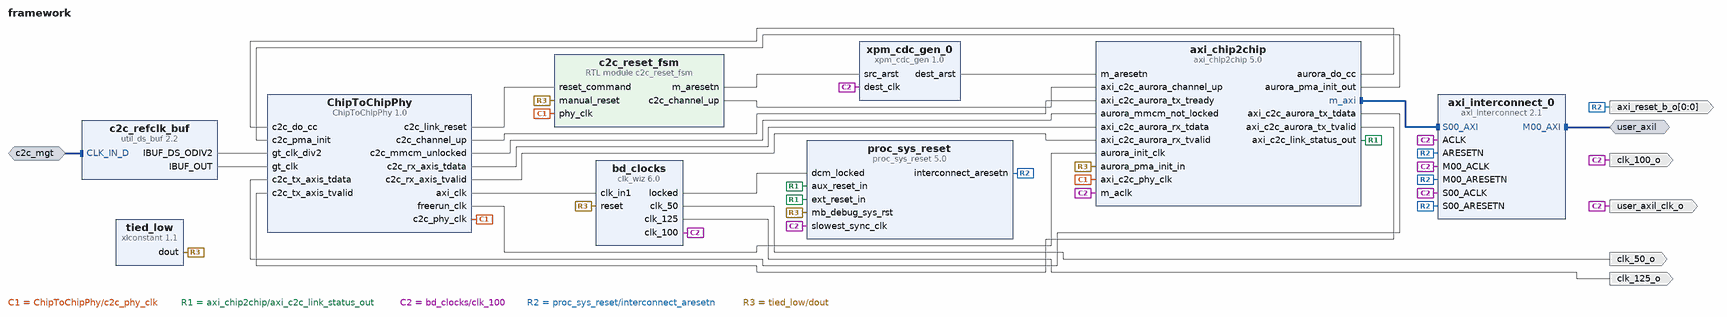
[diagram p0: block diagram of the top level]
# Vivado block design framework, xcvu13p-fsga2577-1-e, Vivado 2021.1
create_bd_design framework

create_bd_intf_port -mode Slave -vlnv xilinx.com:interface:diff_clock_rtl:1.0 c2c_mgt
create_bd_intf_port -mode Master -vlnv xilinx.com:interface:aximm_rtl:1.0 user_axil
set_property -dict [list \
  CONFIG.ADDR_WIDTH 32 \
  CONFIG.DATA_WIDTH 32 \
  CONFIG.HAS_BURST 0 \
  CONFIG.HAS_CACHE 0 \
  CONFIG.HAS_LOCK 0 \
  CONFIG.HAS_QOS 0 \
  CONFIG.HAS_REGION 0 \
  CONFIG.PROTOCOL AXI4LITE \
] [get_bd_intf_ports user_axil]
create_bd_port -dir O -type clk clk_50_o
set_property -dict {CONFIG.FREQ_HZ 50000000} [get_bd_ports clk_50_o]
create_bd_port -dir O -type clk clk_100_o
create_bd_port -dir O -type clk user_axil_clk_o
set_property -dict {CONFIG.ASSOCIATED_BUSIF user_axil CONFIG.ASSOCIATED_RESET axi_reset_b_o} [get_bd_ports user_axil_clk_o]
create_bd_port -dir O -from 0 -to 0 -type rst axi_reset_b_o
create_bd_port -dir O -type clk clk_125_o
set_property -dict {CONFIG.FREQ_HZ 125000000} [get_bd_ports clk_125_o]

create_bd_cell -type ip -vlnv xilinx.com:ip:axi_chip2chip:5.0 axi_chip2chip
set_property -dict [list \
  CONFIG.C_ECC_ENABLE false \
  CONFIG.C_EN_AXI_LINK_HNDLR true \
  CONFIG.C_INCLUDE_AXILITE 0 \
  CONFIG.C_INTERFACE_MODE 1 \
  CONFIG.C_INTERFACE_TYPE 3 \
  CONFIG.C_MASTER_FPGA 0 \
  CONFIG.C_M_AXI_WUSER_WIDTH 0 \
] [get_bd_cells axi_chip2chip]
create_bd_cell -type ip -vlnv xilinx.com:ip:axi_interconnect:2.1 axi_interconnect_0
set_property -dict {CONFIG.NUM_MI 1} [get_bd_cells axi_interconnect_0]
create_bd_cell -type module -reference c2c_reset_fsm c2c_reset_fsm
create_bd_cell -type ip -vlnv xilinx.com:ip:clk_wiz:6.0 bd_clocks
set_property -dict [list \
  CONFIG.CLKIN1_JITTER_PS 64.0 \
  CONFIG.CLKOUT1_JITTER 222.272 \
  CONFIG.CLKOUT1_PHASE_ERROR 204.239 \
  CONFIG.CLKOUT1_REQUESTED_OUT_FREQ 50 \
  CONFIG.CLKOUT2_JITTER 194.337 \
  CONFIG.CLKOUT2_PHASE_ERROR 204.239 \
  CONFIG.CLKOUT2_USED true \
  CONFIG.CLKOUT3_JITTER 186.558 \
  CONFIG.CLKOUT3_PHASE_ERROR 204.239 \
  CONFIG.CLKOUT3_REQUESTED_OUT_FREQ 125 \
  CONFIG.CLKOUT3_USED true \
  CONFIG.CLK_OUT1_PORT clk_50 \
  CONFIG.CLK_OUT2_PORT clk_100 \
  CONFIG.CLK_OUT3_PORT clk_125 \
  CONFIG.MMCM_CLKFBOUT_MULT_F 32.000 \
  CONFIG.MMCM_CLKIN1_PERIOD 6.400 \
  CONFIG.MMCM_CLKIN2_PERIOD 10.0 \
  CONFIG.MMCM_CLKOUT0_DIVIDE_F 20.000 \
  CONFIG.MMCM_CLKOUT1_DIVIDE 10 \
  CONFIG.MMCM_CLKOUT2_DIVIDE 8 \
  CONFIG.MMCM_DIVCLK_DIVIDE 5 \
  CONFIG.NUM_OUT_CLKS 3 \
  CONFIG.OPTIMIZE_CLOCKING_STRUCTURE_EN true \
  CONFIG.PRIM_IN_FREQ 156.25 \
  CONFIG.PRIM_SOURCE Global_buffer \
] [get_bd_cells bd_clocks]
create_bd_cell -type ip -vlnv xilinx.com:ip:proc_sys_reset:5.0 proc_sys_reset
create_bd_cell -type ip -vlnv xilinx.com:ip:xlconstant:1.1 tied_low
set_property -dict {CONFIG.CONST_VAL 0} [get_bd_cells tied_low]
create_bd_cell -type ip -vlnv xilinx.com:ip:xpm_cdc_gen:1.0 xpm_cdc_gen_0
set_property -dict {CONFIG.CDC_TYPE xpm_cdc_async_rst} [get_bd_cells xpm_cdc_gen_0]
create_bd_cell -type ip -vlnv xilinx.com:ip:util_ds_buf:2.2 c2c_refclk_buf
set_property -dict {CONFIG.C_BUF_TYPE IBUFDSGTE} [get_bd_cells c2c_refclk_buf]
create_bd_cell -type ip -vlnv UF:BlobFiSH:ChipToChipPhy:1.0 ChipToChipPhy
set_property -dict {CONFIG.GT_AXI_DIVIDER 0 CONFIG.GT_RX_POLARITY {"0"} CONFIG.GT_TX_POLARITY {"0"}} [get_bd_cells ChipToChipPhy]

# ---- connections ----

connect_bd_intf_net [get_bd_intf_pins axi_chip2chip/m_axi] [get_bd_intf_pins axi_interconnect_0/S00_AXI]
connect_bd_intf_net [get_bd_intf_ports user_axil] [get_bd_intf_pins axi_interconnect_0/M00_AXI]
connect_bd_intf_net [get_bd_intf_ports c2c_mgt] [get_bd_intf_pins c2c_refclk_buf/CLK_IN_D]
connect_bd_net -net ChipToChipPhy_0_axi_clk [get_bd_pins ChipToChipPhy/axi_clk] [get_bd_pins bd_clocks/clk_in1]
connect_bd_net -net ChipToChipPhy_0_c2c_channel_up [get_bd_pins ChipToChipPhy/c2c_channel_up] [get_bd_pins axi_chip2chip/axi_c2c_aurora_tx_tready]
connect_bd_net -net ChipToChipPhy_0_c2c_link_reset [get_bd_pins ChipToChipPhy/c2c_link_reset] [get_bd_pins c2c_reset_fsm/reset_command]
connect_bd_net -net ChipToChipPhy_0_c2c_mmcm_unlocked [get_bd_pins ChipToChipPhy/c2c_mmcm_unlocked] [get_bd_pins axi_chip2chip/aurora_mmcm_not_locked]
connect_bd_net -net ChipToChipPhy_0_c2c_phy_clk [get_bd_pins ChipToChipPhy/c2c_phy_clk] \
  [get_bd_pins axi_chip2chip/axi_c2c_phy_clk] [get_bd_pins c2c_reset_fsm/phy_clk]
connect_bd_net -net ChipToChipPhy_0_c2c_rx_axis_tdata [get_bd_pins ChipToChipPhy/c2c_rx_axis_tdata] \
  [get_bd_pins axi_chip2chip/axi_c2c_aurora_rx_tdata]
connect_bd_net -net ChipToChipPhy_0_c2c_rx_axis_tvalid [get_bd_pins ChipToChipPhy/c2c_rx_axis_tvalid] \
  [get_bd_pins axi_chip2chip/axi_c2c_aurora_rx_tvalid]
connect_bd_net -net ChipToChipPhy_0_freerun_clk [get_bd_pins ChipToChipPhy/freerun_clk] [get_bd_pins axi_chip2chip/aurora_init_clk]
connect_bd_net -net axi_chip2chip_0_aurora_do_cc [get_bd_pins axi_chip2chip/aurora_do_cc] [get_bd_pins ChipToChipPhy/c2c_do_cc]
connect_bd_net -net axi_chip2chip_0_aurora_pma_init_out [get_bd_pins axi_chip2chip/aurora_pma_init_out] [get_bd_pins ChipToChipPhy/c2c_pma_init]
connect_bd_net -net axi_chip2chip_0_axi_c2c_aurora_tx_tdata [get_bd_pins axi_chip2chip/axi_c2c_aurora_tx_tdata] \
  [get_bd_pins ChipToChipPhy/c2c_tx_axis_tdata]
connect_bd_net -net axi_chip2chip_0_axi_c2c_aurora_tx_tvalid [get_bd_pins axi_chip2chip/axi_c2c_aurora_tx_tvalid] \
  [get_bd_pins ChipToChipPhy/c2c_tx_axis_tvalid]
connect_bd_net -net axi_chip2chip_0_axi_c2c_link_status_out [get_bd_pins axi_chip2chip/axi_c2c_link_status_out] \
  [get_bd_pins proc_sys_reset/ext_reset_in] [get_bd_pins proc_sys_reset/aux_reset_in]
connect_bd_net [get_bd_pins bd_clocks/clk_50] [get_bd_ports clk_50_o]
connect_bd_net [get_bd_pins bd_clocks/clk_100] \
  [get_bd_ports clk_100_o] [get_bd_ports user_axil_clk_o] [get_bd_pins axi_chip2chip/m_aclk] \
  [get_bd_pins axi_interconnect_0/ACLK] [get_bd_pins axi_interconnect_0/S00_ACLK] [get_bd_pins axi_interconnect_0/M00_ACLK] \
  [get_bd_pins proc_sys_reset/slowest_sync_clk] [get_bd_pins xpm_cdc_gen_0/dest_clk]
connect_bd_net [get_bd_pins bd_clocks/clk_125] [get_bd_ports clk_125_o]
connect_bd_net -net c2c_reset_fsm_0_c2c_channel_up [get_bd_pins c2c_reset_fsm/c2c_channel_up] [get_bd_pins axi_chip2chip/axi_c2c_aurora_channel_up]
connect_bd_net [get_bd_pins c2c_reset_fsm/m_aresetn] [get_bd_pins xpm_cdc_gen_0/src_arst]
connect_bd_net -net clk_wiz_0_locked [get_bd_pins bd_clocks/locked] [get_bd_pins proc_sys_reset/dcm_locked]
connect_bd_net [get_bd_pins proc_sys_reset/interconnect_aresetn] \
  [get_bd_ports axi_reset_b_o] [get_bd_pins axi_interconnect_0/ARESETN] [get_bd_pins axi_interconnect_0/S00_ARESETN] \
  [get_bd_pins axi_interconnect_0/M00_ARESETN]
connect_bd_net [get_bd_pins tied_low/dout] \
  [get_bd_pins axi_chip2chip/aurora_pma_init_in] [get_bd_pins c2c_reset_fsm/manual_reset] [get_bd_pins bd_clocks/reset] \
  [get_bd_pins proc_sys_reset/mb_debug_sys_rst]
connect_bd_net -net util_ds_buf_0_IBUF_DS_ODIV2 [get_bd_pins c2c_refclk_buf/IBUF_DS_ODIV2] [get_bd_pins ChipToChipPhy/gt_clk_div2]
connect_bd_net -net util_ds_buf_0_IBUF_OUT [get_bd_pins c2c_refclk_buf/IBUF_OUT] [get_bd_pins ChipToChipPhy/gt_clk]
connect_bd_net [get_bd_pins xpm_cdc_gen_0/dest_arst] [get_bd_pins axi_chip2chip/m_aresetn]

# ---- address map ----
assign_bd_address -offset 0x00000000 -range 256M -target_address_space [get_bd_addr_spaces axi_chip2chip/MAXI] [get_bd_addr_segs user_axil/Reg]

validate_bd_design
save_bd_design
